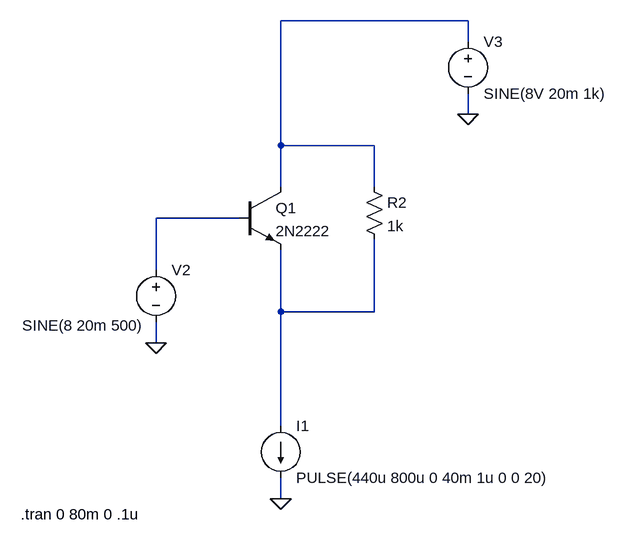
[diagram p0: schematic phaser_study_2.asc]
phaser_study_2.asc, the LTspice schematic file:
Version 4
SHEET 1 880 680
WIRE 528 -112 240 -112
WIRE 528 -80 528 -112
WIRE 528 32 528 0
WIRE 240 80 240 -112
WIRE 384 80 240 80
WIRE 240 144 240 80
WIRE 384 144 384 80
WIRE 176 192 48 192
WIRE 48 272 48 192
WIRE 240 336 240 240
WIRE 384 336 384 224
WIRE 384 336 240 336
WIRE 48 384 48 352
WIRE 240 512 240 336
WIRE 240 624 240 592
FLAG 240 624 0
FLAG 528 32 0
FLAG 48 384 0
SYMBOL npn2 176 144 R0
SYMATTR InstName Q1
SYMATTR Value 2N2222
SYMBOL current 240 512 R0
WINDOW 123 0 0 Left 0
WINDOW 39 0 0 Left 0
SYMATTR InstName I1
SYMATTR Value PULSE(440u 800u 0 40m 1u 0 0 20)
SYMBOL voltage 48 256 R0
WINDOW 3 -206 101 Left 2
WINDOW 123 0 0 Left 0
WINDOW 39 0 0 Left 0
SYMATTR Value SINE(8 20m 500)
SYMATTR InstName V2
SYMBOL voltage 528 -96 R0
WINDOW 123 0 0 Left 0
WINDOW 39 0 0 Left 0
SYMATTR InstName V3
SYMATTR Value SINE(8V 20m 1k)
SYMBOL res 368 128 R0
SYMATTR InstName R2
SYMATTR Value 1k
TEXT -160 648 Left 2 !.tran 0 80m 0 .1u

The netlist it stands for:
* phaser_study_2.asc
Q1 N001 N002 N003 0 2N2222
I1 N003 0 PULSE(440u 800u 0 40m 1u 0 0 20)
V2 N002 0 SINE(8 20m 500)
V3 N001 0 SINE(8V 20m 1k)
R2 N001 N003 1k
.model NPN NPN
.model PNP PNP
.lib standard.bjt
.tran 0 80m 0 .1u
.backanno
.end